# EAGLE design gleis-a-3 (EAGLE 9.6.2)
AUTHOR: Balazs Racz; DRAWING_TITLE: MEB Schalterwerk Projekt; LICENSE: Licensed by the Solderpad Hardware License V2.0; REVIEWER: n/a; REVISION: A; YEAR: 2023
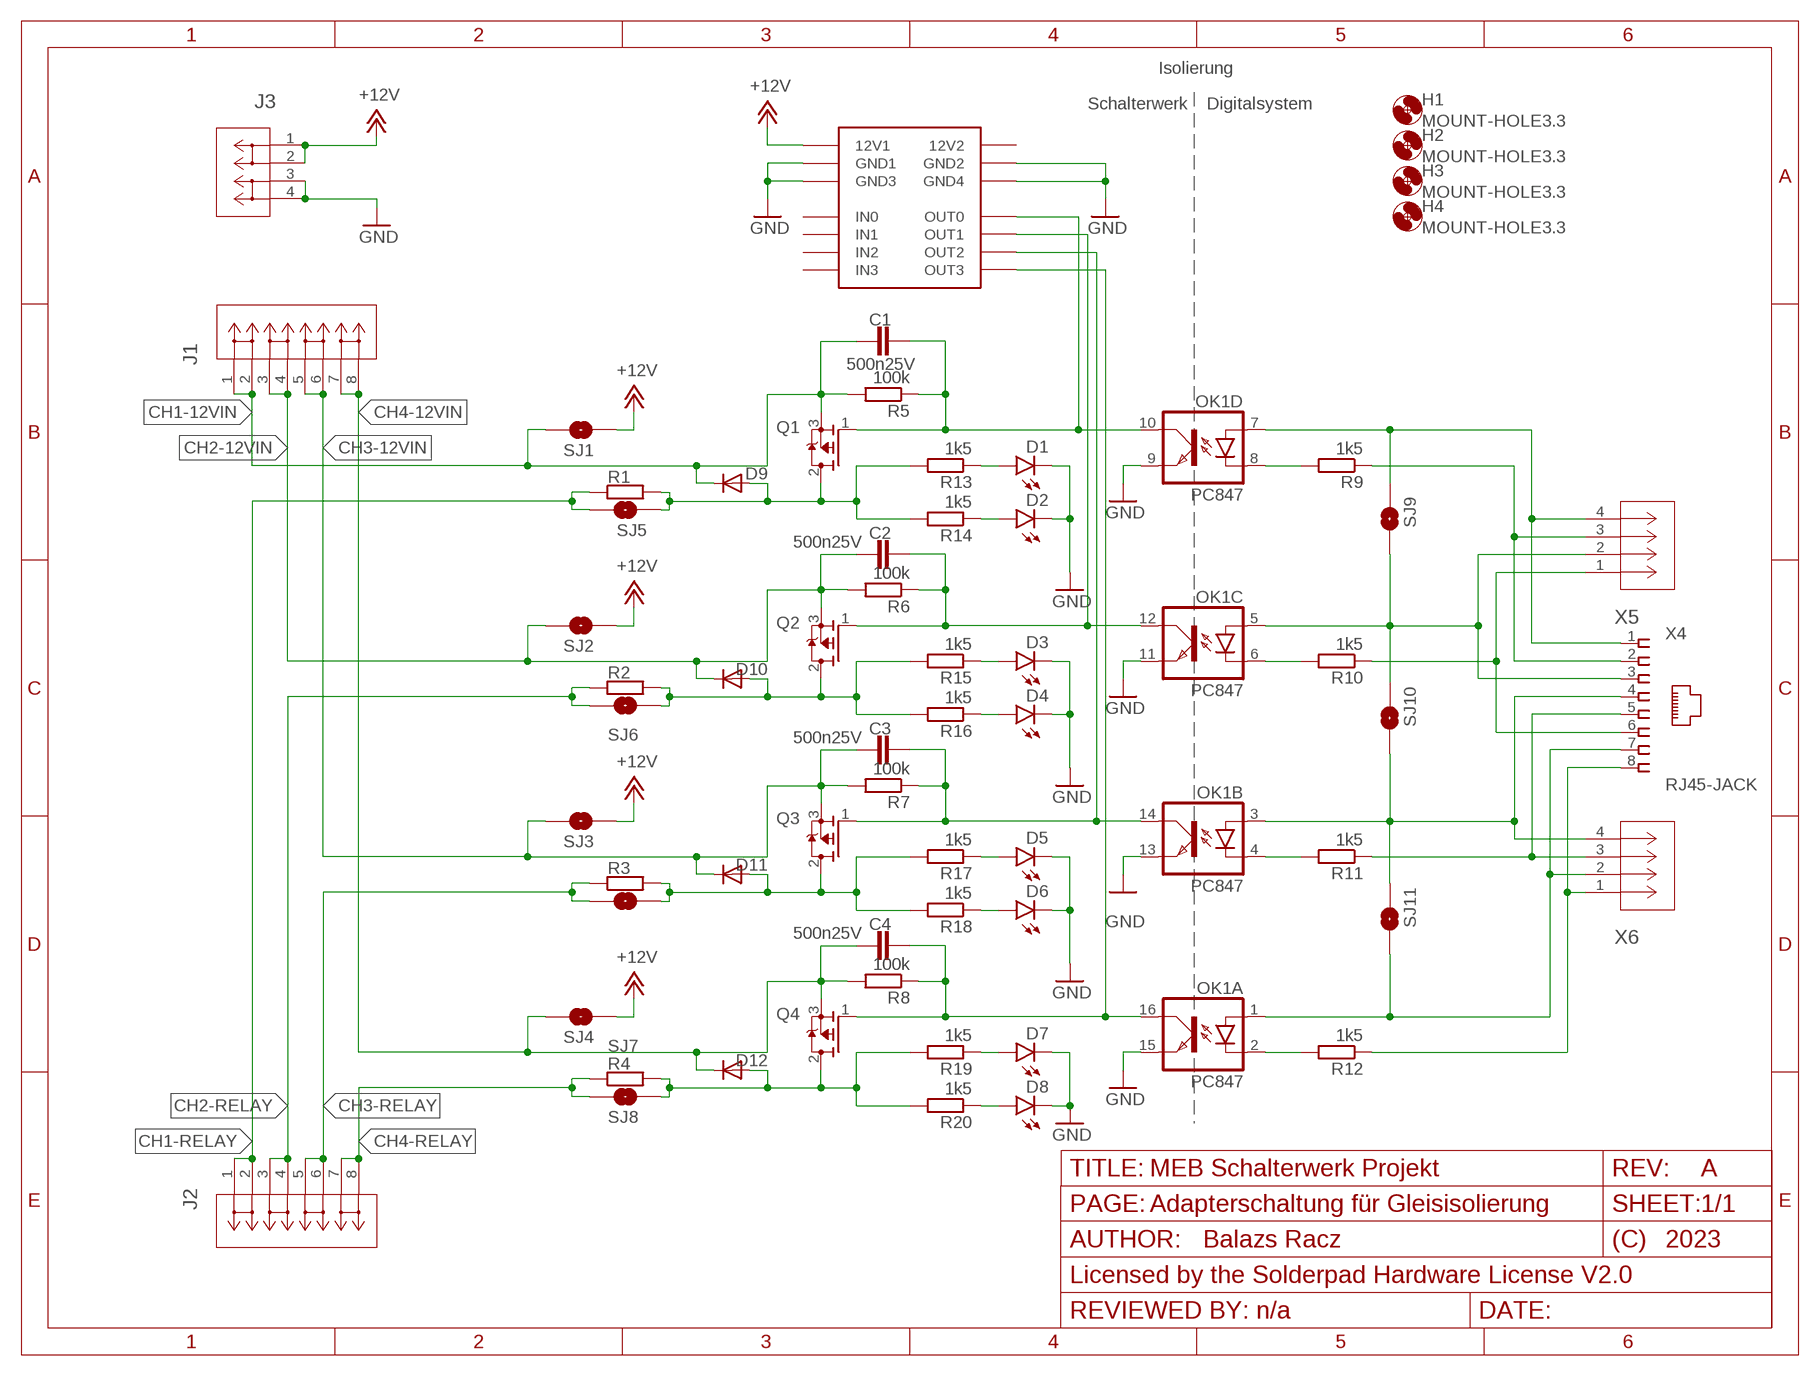
[diagram p0: schematic, sheet 1]
FRAME2 (FRAME_A_L): PAGE: Adapterschaltung für Gleisisolierung
FRAME3 (FRAME_A_L): PAGE: Input ports

## Parts
C1  500n25V  C-EUC0805  [C0805]
C2  500n25V  C-EUC0805  [C0805]
C3  500n25V  C-EUC0805  [C0805]
C4  500n25V  C-EUC0805  [C0805]
D1  LEDCHIPLED_0603  [CHIPLED_0603]
D2  LEDHEADER  [LEDHEADER]
D3  LEDCHIPLED_0603  [CHIPLED_0603]
D4  LEDHEADER  [LEDHEADER]
D5  LEDCHIPLED_0603  [CHIPLED_0603]
D6  LEDHEADER  [LEDHEADER]
D7  LEDCHIPLED_0603  [CHIPLED_0603]
D8  LEDHEADER  [LEDHEADER]
D9  DIODEDO-214AA-NODOC  [DO214AA-NODOC]
D10  DIODEDO-214AA-NODOC  [DO214AA-NODOC]
D11  DIODEDO-214AA-NODOC  [DO214AA-NODOC]
D12  DIODEDO-214AA-NODOC  [DO214AA-NODOC]
H1  MOUNT-HOLE3.3  [3,3]
H2  MOUNT-HOLE3.3  [3,3]
H3  MOUNT-HOLE3.3  [3,3]
H4  MOUNT-HOLE3.3  [3,3]
J1  PHNX_4P_508CONN_1017493  [PHNX_4P_508]
J2  PHNX_4P_508CONN_1017493  [PHNX_4P_508]
J3  PHNX_2P_508CONN_1017491  [PHNX_2P_508]
OK1  PC847  [DIL16]
Q1  P-MOSFET  [DPAK-2]
Q2  P-MOSFET  [DPAK-2]
Q3  P-MOSFET  [DPAK-2]
Q4  P-MOSFET  [DPAK-2]
R1  R-EU_VTA52  [VTA52]
R2  R-EU_VTA52  [VTA52]
R3  R-EU_VTA52  [VTA52]
R4  R-EU_VTA52  [VTA52]
R5  100k  R-EU_R0805  [R0805]
R6  100k  R-EU_R0805  [R0805]
R7  100k  R-EU_R0805  [R0805]
R8  100k  R-EU_R0805  [R0805]
R9  1k5  R-EU_R0805  [R0805]
R10  1k5  R-EU_R0805  [R0805]
R11  1k5  R-EU_R0805  [R0805]
R12  1k5  R-EU_R0805  [R0805]
R13  1k5  R-EU_R0805  [R0805]
R14  1k5  R-EU_R0805  [R0805]
R15  1k5  R-EU_R0805  [R0805]
R16  1k5  R-EU_R0805  [R0805]
R17  1k5  R-EU_R0805  [R0805]
R18  1k5  R-EU_R0805  [R0805]
R19  1k5  R-EU_R0805  [R0805]
R20  1k5  R-EU_R0805  [R0805]
SJ1  SJRND2  [SJ_RND2]
SJ2  SJRND2  [SJ_RND2]
SJ3  SJRND2  [SJ_RND2]
SJ4  SJRND2  [SJ_RND2]
SJ5  SJRND2  [SJ_RND2]
SJ6  SJRND2  [SJ_RND2]
SJ7  SJRND2  [SJ_RND2]
SJ8  SJRND2  [SJ_RND2]
SJ9  SJRND2  [SJ_RND2]
SJ10  SJRND2  [SJ_RND2]
SJ11  SJRND2  [SJ_RND2]
X2  IO-HAT  [IOBOARD]
X4  RJ45-JACK  RJ45-JACKRJ45-PULSE-E5J00  [RJ45-PULSE-E5J88]
X5  PHNX_4P_350CONN_1984989_PXC  [PHNX_4P_350]
X6  PHNX_4P_350CONN_1984989_PXC  [PHNX_4P_350]

## Nets
+12V: J3.1 J3.2 SJ1.P$2 SJ2.P$2 SJ3.P$2 SJ4.P$2 X2.P$1(12V1)
CH1-12VIN: C1.1 D9.C J1.1 J1.2 Q1.3(S) R5.2 SJ1.P$1
CH1-RELAY: J2.1 J2.2 R1.1 SJ5.P$1
CH2-12VIN: C2.1 D10.C J1.3 J1.4 Q2.3(S) R6.2 SJ2.P$1
CH2-RELAY: J2.3 J2.4 R2.1 SJ6.P$1
CH3-12VIN: C3.1 D11.C J1.5 J1.6 Q3.3(S) R7.2 SJ3.P$1
CH3-RELAY: J2.5 J2.6 R3.1 SJ7.P$1
CH4-12VIN: C4.1 D12.C J1.7 J1.8 Q4.3(S) R8.2 SJ4.P$1
CH4-RELAY: J2.7 J2.8 R4.1 SJ8.P$1
GND: D1.C D2.C D3.C D4.C D5.C D6.C D7.C D8.C J3.3 J3.4 OK1.9(D:EMIT) OK1.11(C:EMIT) OK1.13(B:EMIT) OK1.15(A:EMIT) X2.P$2(GND1) X2.P$11(GND3) X2.P$12(GND4) X2.P$21(GND2)
N$1: D9.A Q1.2(D) R1.2 R13.2 R14.2 SJ5.P$2
N$2: C2.2 OK1.12(C:COL) Q2.1(G) R6.1 X2.P$19(OUT1)
N$5: C3.2 OK1.14(B:COL) Q3.1(G) R7.1 X2.P$18(OUT2)
N$7: OK1.4(B:C) R11.2
N$8: D1.A R13.1
N$9: C1.2 OK1.10(D:COL) Q1.1(G) R5.1 X2.P$20(OUT0)
N$10: D10.A Q2.2(D) R2.2 R15.2 R16.2 SJ6.P$2
N$11: D11.A Q3.2(D) R3.2 R17.2 R18.2 SJ7.P$2
N$12: C4.2 OK1.16(A:COL) Q4.1(G) R8.1 X2.P$17(OUT3)
N$13: D12.A Q4.2(D) R4.2 R19.2 R20.2 SJ8.P$2
N$17: OK1.8(D:C) R9.2
N$18: OK1.6(C:C) R10.2
N$19: OK1.2(A:C) R12.2
N$21: D2.A R14.1
N$23: D3.A R15.1
N$24: D4.A R16.1
N$25: D5.A R17.1
N$27: D6.A R18.1
N$29: D7.A R19.1
N$30: D8.A R20.1
NX41: OK1.7(D:A) SJ9.P$2 X4.1 X5.4
NX42: R9.1 X4.2 X5.3
NX43: OK1.5(C:A) SJ9.P$1 SJ10.P$2 X4.3 X5.2
NX44: OK1.3(B:A) SJ10.P$1 SJ11.P$2 X4.4 X6.4
NX45: R11.1 X4.5 X6.3
NX46: R10.1 X4.6 X5.1
NX47: OK1.1(A:A) SJ11.P$1 X4.7 X6.2
NX48: R12.1 X4.8 X6.1
Unconnected: X2.P$3(IN0) X2.P$4(IN1) X2.P$5(IN2) X2.P$6(IN3) X2.P$7(IN4) X2.P$8(IN5) X2.P$9(IN6) X2.P$10(IN7) X2.P$13(OUT7) X2.P$14(OUT6) X2.P$15(OUT5) X2.P$16(OUT4)

## Notes on the sheet
- Isolierung
- Schalterwerk | Digitalsystem

## Power pins joined to a net without a drawn wire
12V2: X2.P$22(12V2)

## Library data of the parts
C1-C4 = rcl:C-EU: CAPACITOR, European symbol; SPICEPREFIX: C
D1 D3 D5 D7 = led:LED: LED OSRAM: - CHIPLED LG R971, LG N971, LY N971, LG Q971, LY Q971, LO R971, LY R971 LH N974, LH R974 LS Q976, LO Q976, LY Q976 LO Q996 - Hyper CHIPLED LW Q18S LB Q993, LB Q99A, LB R99A - SideLED LS A670, LO A670, LY A670, LG A670, LP A670 LB A673, LV A673, LT A673, LW A673 LH A674 LY A675 LS A676, LA A676, LO A676, LY A676, LW A676 LS A679, LY A679, LG A679 - Hyper Micro SIDELED® LS Y876, LA Y876, LO Y876, LY Y876 LT Y87S - SmartLED LW L88C, LW L88S LB L89C, LB L89S, LG L890 LS L89K, LO L89K, LY L89K LS L896, LA L896, LO L896, LY L896 - TOPLED LS T670, LO T670, LY T670, LG T670, LP T670 LSG T670, LSP T670, LSY T670, LOP T670, LYG T670 LG T671, LOG T671, LSG T671 LB T673, LV T673, LT T673, LW T673 LH T674 LS T676, LA T676, LO T676, LY T676, LB T676, LH T676, LSB T676, LW T676 LB T67C, LV T67C, LT T67C, LS T67K, LO T67K, LY T67K, LW E67C LS E67B, LA E67B, LO E67B, LY E67B, LB E67C, LV E67C, LT E67C LW T67C LS T679, LY T679, LG T679 LS T770, LO T770, LY T770, LG T770, LP T770 LB T773, LV T773, LT T773, LW T773 LH T774 LS E675, LA E675, LY E675, LS T675 LS T776, LA T776, LO T776, LY T776, LB T776 LHGB T686 LT T68C, LB T68C - Hyper Mini TOPLED® LB M676 - Mini TOPLED Santana® LG M470 LS M47K, LO M47K, LY M47K Source: http://www.osram.convergy.de LUXEON: - LUMILED® LXK2-PW12-R00, LXK2-PW12-S00, LXK2-PW14-U00, LXK2-PW14-V00 LXK2-PM12-R00, LXK2-PM12-S00, LXK2-PM14-U00 LXK2-PE12-Q00, LXK2-PE12-R00, LXK2-PE12-S00, LXK2-PE14-T00, LXK2-PE14-U00 LXK2-PB12-K00, LXK2-PB12-L00, LXK2-PB12-M00, LXK2-PB14-N00, LXK2-PB14-P00, LXK2-PB14-Q00 LXK2-PR12-L00, LXK2-PR12-M00, LXK2-PR14-Q00, LXK2-PR14-R00 LXK2-PD12-Q00, LXK2-PD12-R00, LXK2-PD12-S00 LXK2-PH12-R00, LXK2-PH12-S00 LXK2-PL12-P00, LXK2-PL12-Q00, LXK2-PL12-R00 Source: www.luxeon.com KINGBRIGHT: KA-3528ASYC Source: www.kingbright.com
D2 D4 D6 D8 = eagleparts:LEDHEADER
D9-D12 = trainlib:DIODE
H1-H4 = holes:MOUNT-HOLE: MOUNTING HOLE with drill center marker
J1 J2 = eagleparts:PHNX_4P_508: https://www.digikey.com/en/products/detail/phoenix-contact/1017505/9346606 DigiKey 277-17516-ND; COPYRIGHT: Copyright (C) 2023 Ultra Librarian. All rights reserved.; MANUFACTURER_PART_NUMBER: 1017505; MFR_NAME: Phoenix Contact
J3 = eagleparts:PHNX_2P_508: https://www.digikey.com/en/products/detail/phoenix-contact/1017503/9346604 DigiKey 277-17514-ND; COPYRIGHT: Copyright (C) 2023 Ultra Librarian. All rights reserved.; MANUFACTURER_PART_NUMBER: 1017503; MFR_NAME: Phoenix Contact
OK1 = optocoupler:PC847: SHARP OPTO COUPLER; OC_FARNELL: 9707735; OC_NEWARK: unknown
Q1-Q4 = eagleparts:P-MOSFET: RoHS Compliant | Low RDS(on) | Industry-leading quality | Dynamic dv/dt Rating | Fast Switching | Fully Avalanche Rated | 175C Operating Temperature | P-Channel MOSFET; MANUFACTURER: Infineon; MAXIMUM_PACKAGE_HEIGHT: 2.39 mm; PARTREV: 12/14/04; STANDARD: IPC-7351B
R1-R20 = rcl:R-EU_: RESISTOR, European symbol; SPICEPREFIX: R
SJ1-SJ11 = eagleparts:SJ: SMD solder JUMPER
X2 = eagleparts:IO-HAT
X4 = trainlib:RJ45-JACK: Mod. Jack, Right Angle, 8 posiotion, 8 contatcs RJ45 Source: GLX-S-88M.pdf
X5 X6 = eagleparts:PHNX_4P_350: https://www.digikey.com/en/products/detail/phoenix-contact/1984989/2513979 DigiKey 277-6404-ND; COPYRIGHT: Copyright (C) 2023 Ultra Librarian. All rights reserved.; MANUFACTURER_PART_NUMBER: 1984989; MFR_NAME: Phoenix Contact

## Board
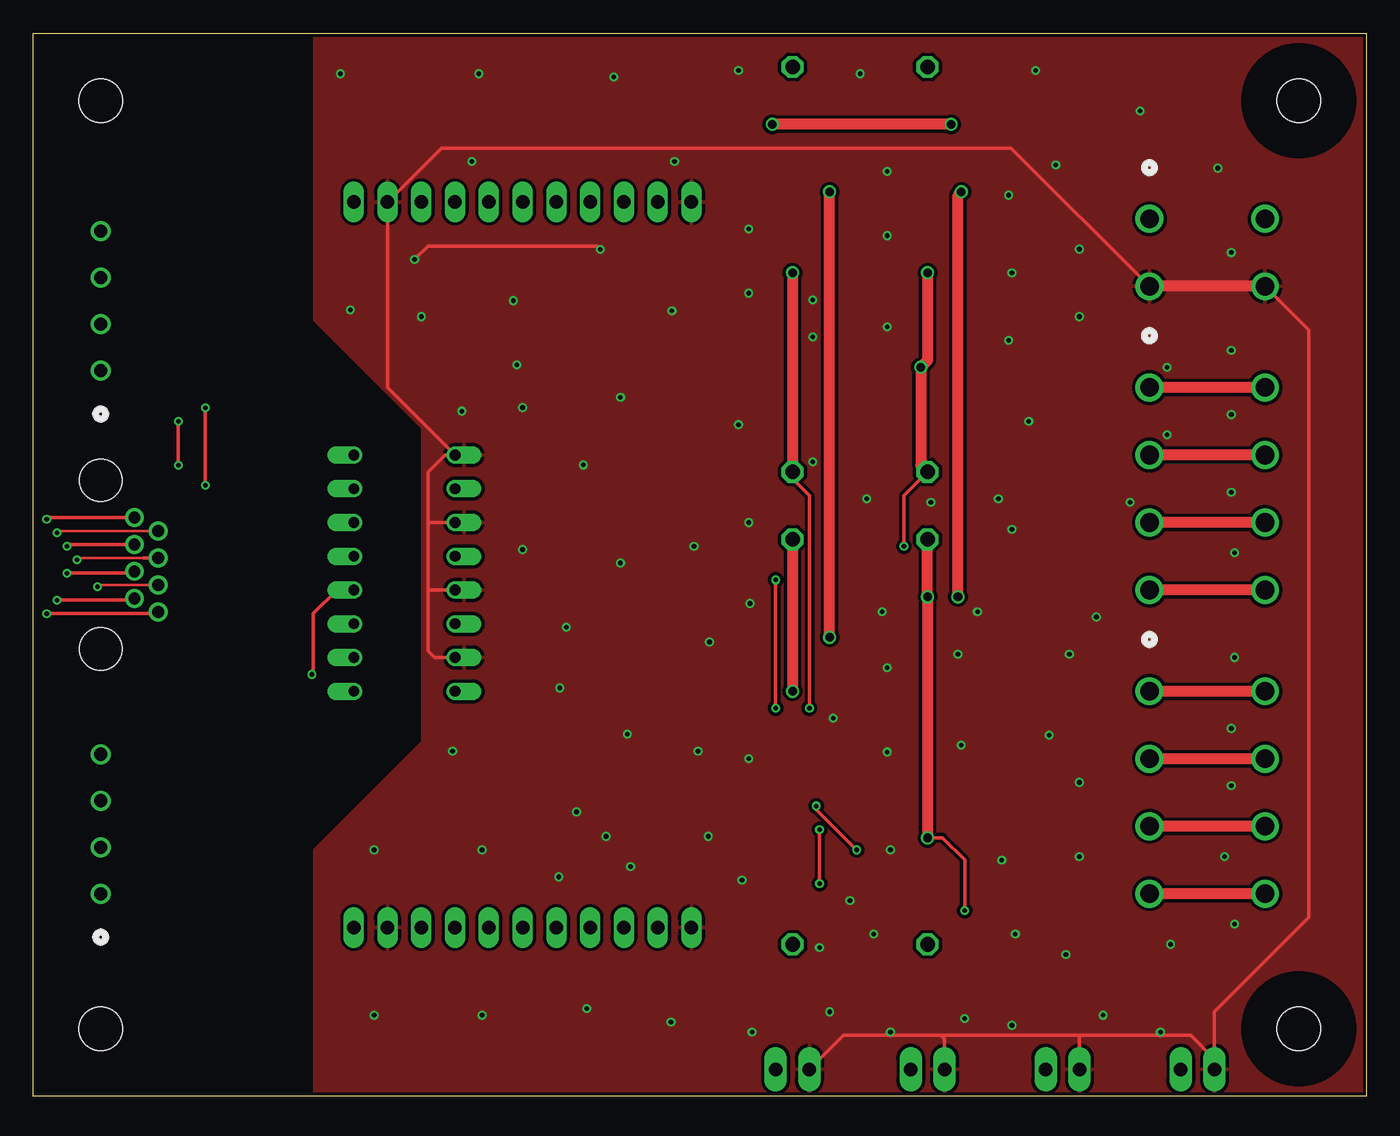
[diagram p1: board, top side]
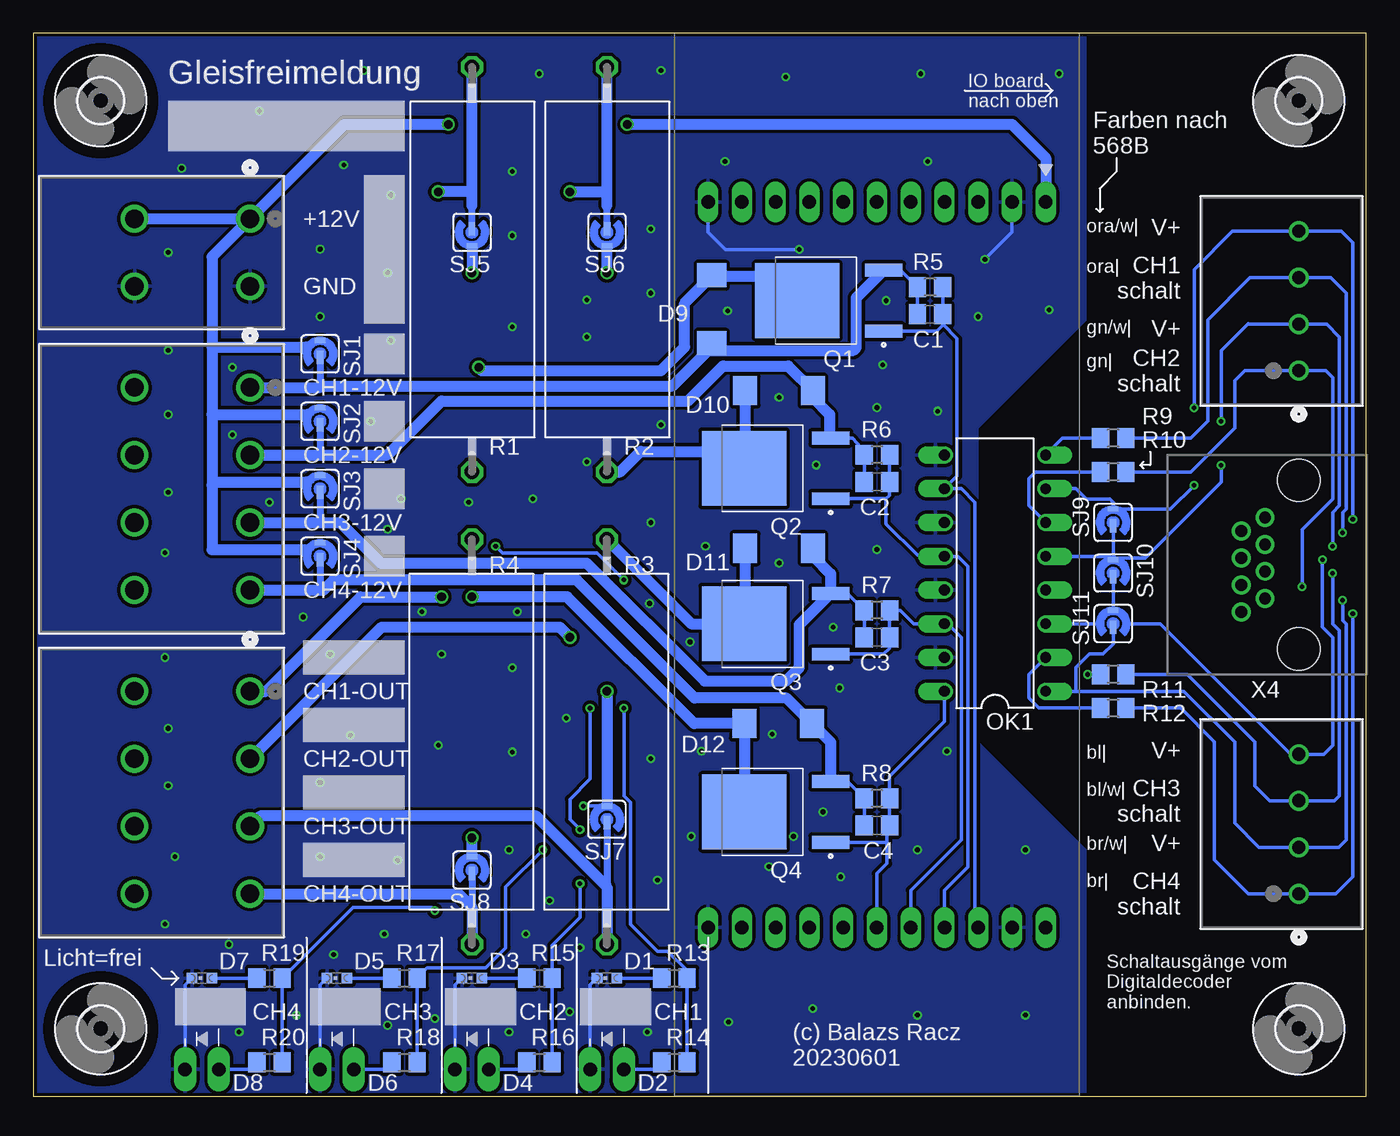
[diagram p2: board, bottom side, seen from below]

Size 100.33 x 80.01 mm. Coordinates in mm from the lower left corner, seen from the top.
Outline: 100.33,0 0,0 0,80.01 100.33,80 100.33,0
Copper layers (1*16): Top 0.035mm / dielectric 1.5mm / Bottom 0.035mm
Design rules "SeeedStudio_2layer_DRU_no_angle_20140221": minimum track width 6mil, minimum drill 12mil, track to track 6mil, track to pad 6mil, pad to pad 6mil, via to via 6mil, smd to smd 0mil, copper to edge 10mil, drill to drill 10mil, minimum pad ring 10mil, minimum via ring 6mil, stop-mask expansion 2mil, vias tented up to drill 100mil, thermal gap 10mil

### Footprints (pad centres in the part's own frame; a part is rotated, then mirrored left to right if it is on the bottom)
C0805 = smd 1.3 x 1.5: 1 -0.95,0; 2 0.95,0
CHIPLED_0603 = smd 0.8 x 0.8: A 0,-0.75; C 0,0.75
LEDHEADER = drill 1.016 pad 1.676 long: A -1.27,0; C 1.27,0
DO214AA-NODOC = smd 1.8 x 2.2: A 2.55,0; C -2.55,0
3,3 = hole 3.3: 0,0
PHNX_4P_508 = drill 1.397 pad 1.905: 1 -15.24,8.7; 2 -15.24,0; 3 -10.16,8.7; 4 -10.16,0; 5 -5.08,8.7; 6 -5.08,0; 7 0,8.7; 8 0,0
PHNX_2P_508 = drill 1.397 pad 1.905: 1 -5.08,8.7; 2 -5.08,0; 3 0,8.7; 4 0,0
DIL16 = drill 0.813 offset: 1 -8.89,-3.81; 2 -6.35,-3.81; 3 -3.81,-3.81; 4 -1.27,-3.81; 5 1.27,-3.81; 6 3.81,-3.81; 7 6.35,-3.81; 8 8.89,-3.81; 9 8.89,3.81; 10 6.35,3.81; 11 3.81,3.81; 12 1.27,3.81; 13 -1.27,3.81; 14 -3.81,3.81; 15 -6.35,3.81; 16 -8.89,3.81
DPAK-2 = smd 2.83 x 0.97: 1 -4.14,2.29; 3 -4.14,-2.29 | smd 6.35 x 5.63: 2 2.38,0
VTA52 = drill 1.1 octagon: 1 -15.24,0; 2 15.24,0
R0805 = smd 1.3 x 1.5: 1 -0.95,0; 2 0.95,0
SJ_RND2 = smd 1.016 x 0.508: P$1 -0.254,0 | smd 0.406 x 0.813: P$2 1.016,0
IOBOARD = drill 1.016 pad 1.524 long: P$1 12.7,27.94; P$2 12.7,25.4; P$3 12.7,22.86; P$4 12.7,20.32; P$5 12.7,17.78; P$6 12.7,15.24; P$7 12.7,12.7; P$8 12.7,10.16; P$9 12.7,7.62; P$10 12.7,5.08; P$11 12.7,2.54; P$12 67.31,2.54; P$13 67.31,5.08; P$14 67.31,7.62; P$15 67.31,10.16; P$16 67.31,12.7; P$17 67.31,15.24; P$18 67.31,17.78; P$19 67.31,20.32; P$20 67.31,22.86; P$21 67.31,25.4; P$22 67.31,27.94
RJ45-PULSE-E5J88 = drill 0.9 pad 1.422: 1 3.555,2.54; 2 2.535,4.32; 3 1.515,2.54; 4 0.495,4.32; 5 -0.495,2.54; 6 -1.515,4.32; 7 -2.535,2.54; 8 -3.555,4.32 | hole 3.2: 6.35,0; -6.35,0
PHNX_4P_350 = drill 0.991 pad 1.499: 1 0,0; 2 3.5,0; 3 7,0; 4 10.5,0

### Placement (x,y rotation side)
C1  32.83,58.86 0 bottom
C2  36.83,46.24 0 bottom
C3  36.83,34.54 0 bottom
C4  36.83,20.38 0 bottom
D1  57.15,8.89 90 bottom
D2  57.15,2.02 180 bottom
D3  67.31,8.89 90 bottom
D4  67.31,2.02 180 bottom
D5  77.47,8.89 90 bottom
D6  77.47,2.02 180 bottom
D7  87.63,8.89 90 bottom
D8  87.63,2.02 180 bottom
D9  49.25,59.24 90 bottom
D10  44.2,53.1 180 bottom
D11  44.2,41.25 180 bottom
D12  44.25,28.05 180 bottom
H1  5.08,74.93 0 bottom
H2  5.08,5.08 0 bottom
H3  95.25,5.08 0 bottom
H4  95.25,74.93 0 bottom
J1  92.71,38.1 270 bottom
J2  92.71,15.24 270 bottom
J3  92.71,60.96 270 bottom
OK1  27.94,39.37 90 bottom
Q1  40.45,59.88 180 bottom
Q2  44.45,47.26 180 bottom
Q3  44.45,35.56 180 bottom
Q4  44.45,21.4 180 bottom
R1  67.31,62.23 270 bottom
R2  57.15,62.23 270 bottom
R3  57.15,26.67 90 bottom
R4  67.31,26.67 90 bottom
R5  32.83,60.9 180 bottom
R6  36.83,48.28 180 bottom
R7  36.83,36.58 180 bottom
R8  36.83,22.42 180 bottom
R9  19.05,49.53 180 bottom
R10  19.05,46.99 180 bottom
R11  19.05,31.75 180 bottom
R12  19.05,29.21 180 bottom
R13  52.07,8.89 0 bottom
R14  52.07,2.54 0 bottom
R15  62.23,8.89 0 bottom
R16  62.23,2.54 0 bottom
R17  72.39,8.89 0 bottom
R18  72.39,2.54 0 bottom
R19  82.55,8.89 0 bottom
R20  82.55,2.54 0 bottom
SJ1  78.74,55.88 90 bottom
SJ2  78.74,50.8 90 bottom
SJ3  78.74,45.72 90 bottom
SJ4  78.74,40.64 90 bottom
SJ5  67.31,65.02 270 bottom
SJ6  57.15,65.02 270 bottom
SJ7  57.15,20.83 90 bottom
SJ8  67.31,17.02 90 bottom
SJ9  19.05,43.18 90 bottom
SJ10  19.05,39.37 90 bottom
SJ11  19.05,35.56 90 bottom
X2  52.07,80.01 270 bottom
X4  5.08,40.01 90 bottom
X5  5.08,54.61 90 bottom
X6  5.08,15.24 90 bottom

### Tracks (layer width: path | path; a pad name or v marks a point on that pad's centre or on a via)
+12V  (via drill 0.65)
  Top 0.813: v69.09,73.15 v55.63,73.15
  Bottom 0.254: 79.76,56.39 79.5,56.39 78.99,56.9 SJ1.P$2 | 79.71,51.31 79.5,51.31 78.99,51.82 SJ2.P$2 | 79.76,46.23 79.25,46.74 SJ3.P$2 | 79.76,41.15 79.5,41.15 78.99,41.66 SJ4.P$2
  Bottom 0.813: J3.1 86.87,63.18 86.87,56.39 | 86.87,56.39 86.87,51.31 | 86.87,51.31 86.87,45.97 | 86.87,45.97 86.87,41.15 79.76,41.15 | 86.87,45.97 86.61,46.23 79.76,46.23 | 86.87,51.31 79.71,51.31 | 86.87,56.39 79.76,56.39 | J3.2 J3.1 | J3.1 76.9,73.15 v69.09,73.15 | v55.63,73.15 26.67,73.15 24.13,70.61 X2.P$1
CH1-12VIN
  Top 0.813: J1.2 J1.1
  Bottom 0.254: C1.1 R5.2 35.05,62.17 Q1.3
  Bottom 0.508: SJ1.P$1 78.72,53.44 78.72,53.34 78.74,53.34
  Bottom 0.813: J1.1 78.74,53.34 | Q1.3 38.39,60.09 38.39,56.36 38.61,56.13 49.53,56.13 | 78.72,53.44 52.21,53.45 49.53,56.13 | D9.C 49.53,56.41 49.53,56.13
CH1-RELAY  (via drill 0.65)
  Top 0.813: J2.2 J2.1 | v69.6,37.59 69.6,67.82 v69.85,68.07
  Bottom 0.508: SJ5.P$1 67.31,67.06
  Bottom 0.813: 67.31,67.06 67.31,68.33 | 67.31,68.33 R1.1 | 67.31,68.33 67.56,68.07 v69.85,68.07 | J2.1 82.8,30.48 75.69,37.59 v69.6,37.59
CH2-12VIN
  Top 0.813: J1.4 J1.3
  Bottom 0.254: 40.39,49.55 Q2.3 38.68,49.55 37.64,48.42 R6.2 C2.1
  Bottom 0.508: SJ2.P$1 78.74,48.26
  Bottom 0.813: J1.3 78.74,48.26 73.66,48.26 69.58,52.34 51.04,52.34 48.41,54.97 43.51,54.97 D10.C 41.65,52.57 40.39,51.31 40.39,49.55
CH2-RELAY  (via drill 0.65)
  Top 0.813: J2.4 J2.3 | v59.94,34.54 v59.94,68.07
  Bottom 0.508: SJ6.P$1 57.15,67.06
  Bottom 0.813: 57.15,67.06 57.15,68.07 | 57.15,68.07 R2.1 | J2.3 74.1,35.31 60.71,35.31 v59.94,34.54 | v59.94,68.07 57.15,68.07
CH3-12VIN
  Top 0.813: J1.6 J1.5
  Bottom 0.254: C3.1 R7.2 39.05,37.85 Q3.3
  Bottom 0.508: SJ3.P$1 78.74,43.18
  Bottom 0.813: J1.5 78.74,43.18 77.22,43.18 74.17,40.13 58.67,40.13 49.78,31.24 43.69,31.24 42.67,32.26 42.67,35.49 Q3.3 40.31,39.31 41.65,40.65 D11.C
CH3-RELAY
  Top 0.813: J2.6 J2.5
  Bottom 0.508: SJ7.P$1 57.15,15.75
  Bottom 0.813: J2.5 83.25,21.08 62.48,21.08 57.15,15.75 R3.1
CH4-12VIN
  Top 0.813: J1.8 J1.7
  Bottom 0.254: C4.1 R8.2 39.05,23.69 Q4.3
  Bottom 0.508: 78.99,38.1 78.74,38.35 SJ4.P$1
  Bottom 0.813: J1.7 78.99,38.1 78.49,38.1 77.72,38.86 59.44,38.86 50.55,29.97 43.62,29.97 D12.C 40.31,26.66 Q4.3
CH4-RELAY
  Top 0.813: J2.8 J2.7
  Bottom 0.508: SJ8.P$1 67.31,14.22
  Bottom 0.813: J2.7 68.33,15.24 67.31,14.22 R4.1
GND  (via drill 0.35)
  Top 0.254: OK1.15 30.23,33.02 29.72,33.53 29.72,38.1 | 29.72,38.1 29.72,43.18 | 29.72,43.18 29.72,46.99 30.99,48.26 OK1.9 26.67,53.34 X2.P$2 30.73,71.37 73.6,71.37 J3.3 | OK1.13 29.72,38.1 | OK1.11 29.72,43.18 | D2.C 60.97,4.57 68.33,4.57 | 68.33,4.57 78.74,4.57 | 78.74,4.57 87.12,4.57 88.9,2.79 D8.C 88.9,6.35 96.01,13.46 96.01,57.66 J3.4 | D6.C 78.74,4.57 | D4.C 68.58,4.32 68.33,4.57 | v42.67,63.74 42.42,63.99 29.7,63.99 v28.7,62.99
  Top 0.813: J3.4 J3.3
  Bottom 0.254: D1.C 58.42,8.37 D2.C | D3.C 68.58,8.37 D4.C | D5.C 78.74,8.37 D6.C | D7.C 88.9,8.37 D8.C | X2.P$2 26.67,65.02 v28.7,62.99 | X2.P$11 49.53,65.02 48.24,63.74 v42.67,63.74
  other vias: 53.85,60.45 53.85,65.28 64.26,57.91 64.26,64.77 64.26,69.6 73.41,67.82 73.66,61.98 73.41,56.9 78.74,58.67 78.74,63.75 76.96,70.1 83.31,74.17 89.15,69.85 75.44,77.22 62.23,76.96 53.09,77.22 43.69,76.71 33.02,70.36 48.26,70.36 29.21,58.67 23.11,76.96 33.53,76.96 23.88,59.18 32.26,51.56 36.39,55.05 36.83,51.83 36.83,41.15 41.4,47.51 49.74,41.39 53.85,43.18 62.74,44.96 67.56,44.7 72.64,44.96 74.93,50.8 82.55,44.7 73.66,42.67 80.01,36.07 69.6,33.27 77.98,33.27 64.26,32.26 60.2,28.45 64.26,25.91 69.85,26.42 76.45,27.18 78.74,23.62 53.85,25.4 50.8,19.56 40.89,21.4 40.13,35.31 31.56,25.97 39.62,30.73 33.78,18.54 39.56,16.51 43.12,19.56 44.96,17.27 53.34,16.26 61.47,14.73 63.25,12.19 73.91,12.19 77.72,10.67 85.6,11.43 90.42,12.95 84.84,4.83 73.66,5.33 80.52,6.1 70.1,5.84 64.52,4.83 59.94,6.35 54.1,4.83 48.01,5.59 59.18,11.18 41.66,6.6 33.78,6.1 25.65,6.1 25.65,18.54 78.74,18.03 72.9,17.78 89.66,18.03 90.17,23.37 90.17,27.69 90.42,33.02 90.42,40.89 90.17,45.47 90.17,51.31 90.17,56.13 90.17,63.5 85.34,49.78 85.34,54.86 58.67,59.94 58.67,57.15 58.67,47.75 53.09,50.55 36.13,59.88 48.07,59.12 71.07,36.47 63.91,36.47 50.04,25.97 44.7,27.24 44.2,40.13 53.95,37.08 50.9,34.19 64.52,18.54 44.2,52.59
  pour Bottom (isolate 0.254): 100.08,79.76 100.08,0.25 21.08,0.25 21.08,18.54 29.21,26.67 29.21,50.29 21.08,58.42 21.08,79.76
  pour Top (isolate 0.254): 100.08,0.25 100.08,79.76 21.08,79.76 21.08,58.42 29.21,50.29 29.21,26.67 21.08,18.54 21.08,0.25
N$1  (via drill 0.35, 0.65)
  Top 0.254: R1.2 65.53,45.21 v65.53,41.4 | v55.88,38.86 v55.88,29.21
  Top 0.813: R1.2 66.8,47.5 v66.8,54.86 67.31,55.37 v67.31,61.98
  Bottom 0.254: R14.2 R13.2 51.12,9.46 52.58,10.92 53.34,10.92 55.37,12.95 55.37,22.1 55.88,22.61 v55.88,29.21 | v65.53,41.4 65.02,40.89 57.91,40.89 v55.88,38.86 | SJ5.P$2 67.31,63.97 | D9.A 49.25,61.49 49.28,61.47
  Bottom 0.813: v66.8,54.86 66.55,54.61 53.09,54.61 51.31,56.39 51.31,59.69 49.53,61.47 49.28,61.47 | 67.31,63.97 v67.31,61.98 | D9.A 49.19,61.72 44.67,61.72 Q1.2
N$2
  Bottom 0.254: X2.P$19 31.75,15.49 29.97,17.27 29.97,39.88 30.73,40.64 OK1.12 31.83,40.72 33.78,40.72 36.13,43.07 36.13,44.97 | R6.1 C2.2 35.88,45.23 36.13,44.97 | Q2.1 36.14,44.97 36.13,44.97
N$5
  Bottom 0.254: X2.P$18 34.29,15.49 30.48,19.3 30.48,34.54 31.5,35.56 OK1.14 34.04,35.56 35.05,36.58 R7.1 C3.2 35.88,33.72 36.33,33.27 Q3.1
N$7  (via drill 0.35)
  Top 0.254: v20.98,31.75 21.08,31.85 21.08,36.32 22.86,38.1 OK1.4
  Bottom 0.254: R11.2 v20.98,31.75
N$8
  Bottom 0.254: R13.1 D1.A
N$9
  Bottom 0.254: X2.P$20 29.46,12.95 29.46,44.7 30.48,45.72 OK1.10 30.8,46.67 30.8,57.02 31.88,58.1 | Q1.1 32.33,57.59 31.88,58.04 31.88,58.1 | 31.88,58.1 C1.2 R5.1
N$10  (via drill 0.35, 0.65)
  Top 0.254: R2.2 57.15,46.48 58.42,45.21 v58.42,29.21 | v59.18,20.07 v59.18,16
  Top 0.813: v57.15,61.98 R2.2
  Bottom 0.254: R16.2 R15.2 61.28,11.36 59.18,13.46 v59.18,16 | v58.42,29.21 58.42,23.88 59.94,22.35 59.94,20.83 v59.18,20.07 | SJ6.P$2 57.15,63.97
  Bottom 0.813: R2.2 56.15,46.99 54.61,48.53 48.1,48.53 Q2.2 46.75,47.34 D10.A | v57.15,61.98 57.15,63.97
N$11  (via drill 0.35, 0.65)
  Top 0.254: v61.98,18.54 58.93,21.59 v58.93,21.84
  Top 0.813: R3.2 v57.15,30.48
  Bottom 0.254: R18.2 R17.2 70.68,9.65 66.29,9.65 64.77,11.18 64.77,15.75 v61.98,18.54 | v58.93,21.84 SJ7.P$2 57.15,21.89
  Bottom 0.813: R3.2 50.8,35.56 Q3.2 46.75,35.64 D11.A | v57.15,30.48 57.15,21.89
N$12
  Bottom 0.254: OK1.16 31.75,28.19 35.88,24.06 R8.1 C4.2 36.07,20.19 36.07,19.11 | 36.07,19.11 Q4.1 | 36.07,19.11 36.07,17.52 36.83,16.76 X2.P$17
N$13  (via drill 0.35, 0.65)
  Top 0.254: v70.1,13.97 70.1,17.78 68.44,19.44 v67.31,19.44
  Top 0.813: R4.2 v67.31,37.59 v67.31,19.44
  Bottom 0.254: R20.2 R19.2 76.27,14.22 70.36,14.22 v70.1,13.97 | SJ8.P$2 67.31,18.08
  Bottom 0.813: v67.31,37.59 60.13,37.59 50.59,28.05 D12.A 46.8,21.43 Q4.2 | 67.31,18.08 v67.31,19.44
N$17
  Bottom 0.254: R9.2 22.86,49.53 OK1.8
N$18
  Bottom 0.254: OK1.6 25.4,44.45 25.4,46.48 24.89,46.99 R10.2
N$19
  Bottom 0.254: R12.2 24.64,29.21 25.4,29.97 25.4,31.75 OK1.2
N$21
  Bottom 0.254: R14.1 53.54,2.02 D2.A
N$23
  Bottom 0.254: R15.1 D3.A
N$24
  Bottom 0.254: R16.1 63.7,2.02 D4.A
N$25
  Bottom 0.254: R17.1 D5.A
N$27
  Bottom 0.254: R18.1 73.86,2.02 D6.A
N$29
  Bottom 0.254: R19.1 D7.A
N$30
  Bottom 0.254: R20.1 84.02,2.02 D8.A
NX41  (via drill 0.35)
  Top 0.254: v1.02,43.43 1.14,43.56 X4.1 | v12.95,51.82 v12.95,45.97
  Bottom 0.254: v1.02,43.43 1.02,64.26 1.86,65.11 X5.4 10.07,65.11 12.95,62.23 v12.95,51.82 | OK1.7 21.84,45.72 21.08,44.96 19.3,44.96 19.05,44.7 SJ9.P$2 14.73,44.2 v12.95,45.97
NX42  (via drill 0.35)
  Top 0.203: X4.2 1.9,42.54
  Top 0.254: 1.9,42.54 v1.78,42.42
  Bottom 0.254: v1.78,42.42 1.78,43.94 1.52,44.2 1.52,60.45 2.68,61.61 X5.3 8.75,61.61 11.94,58.42 11.94,50.8 13.21,49.53 R9.1
NX43  (via drill 0.35)
  Top 0.254: X4.3 2.66,41.52 v2.54,41.4 | v10.92,50.8 v10.92,47.5
  Bottom 0.254: v2.54,41.4 2.54,43.94 2.03,44.45 2.03,57.15 2.99,58.11 X5.2 8.83,58.11 8.89,58.17 10.92,56.13 v10.92,50.8 | OK1.5 19.3,40.64 19.18,40.51 | 19.18,40.51 SJ10.P$2 SJ9.P$1 | v10.92,47.5 10.92,46.23 16.64,40.51 19.18,40.51
NX44  (via drill 0.35)
  Top 0.203: 3.42,40.5 8.28,40.5
  Top 0.254: 3.42,40.5 v3.3,40.39 | 8.28,40.5 X4.4
  Bottom 0.254: v3.3,40.39 3.3,35.31 2.54,34.54 2.54,26.42 3.22,25.74 X6.4 5.67,25.74 15.49,35.56 17.78,35.56 18.8,36.58 SJ11.P$2 | SJ11.P$2 SJ10.P$1 | OK1.3 20.07,35.56 19.81,35.81 19.81,36.32 19.56,36.58 SJ11.P$2
NX45  (via drill 0.35)
  Top 0.254: v2.54,39.37 7.48,39.37 X4.5
  Bottom 0.254: v2.54,39.37 2.54,35.56 2.03,35.05 2.03,22.61 2.4,22.24 X6.3 7.25,22.24 8.38,23.37 8.38,26.67 13.46,31.75 R11.1
NX46  (via drill 0.35)
  Top 0.203: X4.6 4.96,38.49
  Top 0.254: 4.96,38.49 v4.83,38.35
  Bottom 0.254: v4.83,38.35 4.83,42.67 2.54,44.96 2.54,54.1 3.05,54.61 X5.1 9.14,54.61 9.91,53.85 9.91,50.29 13.21,46.99 R10.1
NX47  (via drill 0.35)
  Top 0.254: v1.78,37.34 7.49,37.34 X4.7
  Bottom 0.254: v1.78,37.34 1.78,35.81 1.52,35.56 1.52,19.3 2.09,18.74 X6.2 8.07,18.74 9.91,20.57 9.91,26.67 13.72,30.48 21.84,30.48 | 21.84,30.48 OK1.1 | SJ11.P$1 19.05,34.04 19.81,33.27 20.83,33.27 21.84,32.26 21.84,30.48
NX48  (via drill 0.35)
  Top 0.254: v1.02,36.32 9.27,36.32 X4.8
  Bottom 0.254: v1.02,36.32 1.02,16.51 2.29,15.24 X6.1 8.89,15.24 11.43,17.78 11.43,26.67 13.97,29.21 R12.1

### Text on the board
bPlace: IO board / nach oben | Schaltausgänge vom / Digitaldecoder / anbinden.
bNames: Gleisfreimeldung | Farben nach / 568B | +12V | V+ | ora/w| | CH1 / schalt | ora| | GND | V+ | gn/w| | CH2 / schalt | gn| | CH1-12V | CH2-12V | CH3-12V | CH4-12V | CH1-OUT | V+ | bl| | CH2-OUT | bl/w| | CH3 / schalt | CH3-OUT | V+ | br/w| | br| | CH4 / schalt | CH4-OUT | Licht=frei | CH1 | CH2 | CH3 | CH4 | (c) Balazs Racz / 20230601